# Altium schematic sheet 04-3V3_Monitor.SchDoc
size A; SheetNumber: 2; SheetTotal: 6
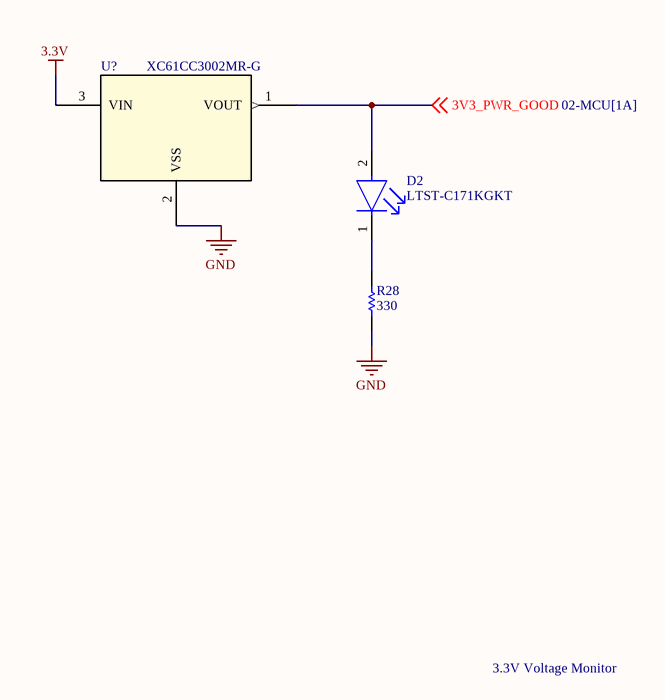
[diagram p0: 04-3V3_Monitor.SchDoc]

## Parts
D2  LTST-C171KGKT  [FP-LTST-C171KGKT-MFG]
R28  330  [RES_0805]
U?  XC61CC3002MR-G  [XC61C_SOT-23_TOR]

## Nets
3.3V: U?.3(VIN)
GND: R28.1 U?.2(VSS)
3V3_PWR_GOOD: D2.2(A) U?.1(VOUT) ; off-sheet 3V3_PWR_GOOD
NetD2_1: D2.1(C) R28.2

## Notes on the sheet
- 3.3V Voltage Monitor

## Library data of the parts
D2 = CMP-22017-000037-1: LED GREEN CLEAR SMD; Number of LEDs: 1; Viewing Angle: 130°; Lens Style: Rectangular; Dominant Wavelength: 571nm; Test Current: 20mA; Luminous Intensity: 35mcd; Power Rating: 75mW; Forward Voltage: 2.4V; Forward Current: 30mA; Reverse Voltage: 5V; Lens Color: Colorless; Wavelength: 574nm; Height: 0.8mm; Illumination Color: Green; Length: 2mm; Case/Package: 0805; Number of Pins: 2; Number of Elements: 1; Package Quantity: 1; Depth: 1.25mm; Lens Transparency: Clear; Width: 1.25mm; Color: Green; Radiation Hardening: No; Mount: Surface Mount; Packaging: Tape and Reel; Case Code (Metric): 2012; Lead Free: Lead Free; Max Operating Temperature: 85°C; Min Operating Temperature: -55°C; Case Code (Imperial): 0805; Power Dissipation: 75mW
R28 = RES_0805_R_330.00: RES 330 OHM 1% 1/8W 0805; Manufacturer 1: Stackpole Electronics; Manufacturer Part Number 1: RMCF0805FT330R; Temperature Coefficient: 100ppm/°C; Resistance: 330R; Max Power Dissipation: 125mW; Features: Automotive AEC-Q200; Number of Terminations: 2; RoHS: Yes; Packaging: Tape and Reel; Tolerance: 1%; Category: Chip SMD Resistors; Supplier 1: Digi-Key; Supplier Part Number 1: RMCF0805FT330RCT-ND; Stock 1: 205996; Pricing 1: 1=0.10000, 10=0.02700, 100=0.01090, 1000=0.00488, 2500=0.00423 (USD); Mount: Surface Mount; Case/Package: 0805; Case Code (Metric): 2012; Case Code (Imperial): 0805; Contact Plating: Tin,Matte; Min Operating Temperature: -55°C; Max Operating Temperature: 155°C; Resistor Type: Thick Film; Series: RMCF; Construction: Rectangular; Length: 0.079inch; Width: 0.049inch; Height: 0.026inch; Depth: 1.25mm; Radiation Hardening: No; Military Standard: Not; Lead Free: Lead Free; RoHS Compliant: Yes; ComponentLink1URL: http://components.arrow.com/part/dataview/40963487S9848862N1174?src-supplier=Arrow+Electronics; ComponentLink1Description: http://components.arrow.com/part/dataview/40963487S9848862N1174?src-supplier=Arrow+Electronics; ComponentLink2URL: https://www.seielect.com/catalog/SEI-RMCF_RMCP.pdf?src-supplier=Avnet; ComponentLink2Description: https://www.seielect.com/catalog/SEI-RMCF_RMCP.pdf?src-supplier=Avnet; ComponentLink3URL: https://www.seielect.com/Catalog/SEI-RMCF_RMCP.pdf?src-supplier=Digi-Key; ComponentLink3Description: https://www.seielect.com/Catalog/SEI-RMCF_RMCP.pdf?src-supplier=Digi-Key; ComponentLink4URL: https://www.seielect.com/catalog/SEI-Packaging.pdf?src-supplier=Digi-Key; ComponentLink4Description: https://www.seielect.com/catalog/SEI-Packaging.pdf?src-supplier=Digi-Key; ComponentLink5URL: https://www.verical.com/server-webapp/html/getDatasheet?partID=559884&src-supplier=Verical; ComponentLink5Description: https://www.verical.com/server-webapp/html/getDatasheet?partID=559884&src-supplier=Verical
U? = XC61CC3002MR-G: IC SUPERVISOR 1 CHANNEL SOT23; Mfr_Name: Torex Semiconductor; Copyright: Copyright (C) 2022 Ultra Librarian. All rights reserved.; Manufacturer_Part_Number: XC61CC3002MR-G; Digi-Key_Part_Number_1: 893-1029-1-ND; Digi-Key_Part_Number_2: 893-1029-2-ND; Digi-Key_Part_Number_3: 893-1029-6-ND; RefDes: RefDes; Type: DEV; Supplier 1: Digi-Key; Supplier Part Number 1: 893-1029-1-ND